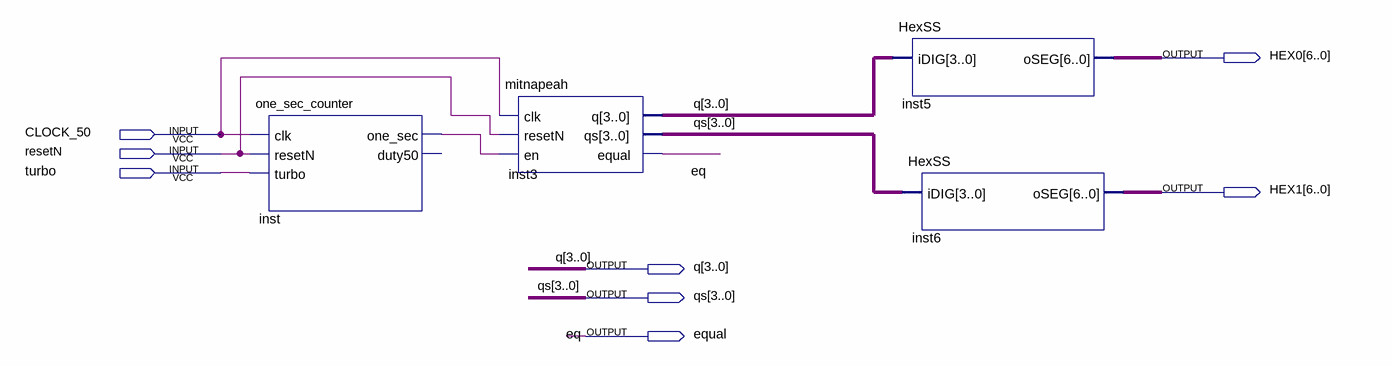
[diagram p0: schematic sheet]
// Quartus schematic mitnapeah_top.bdf as structural Verilog: 4 symbols, 8 pins
module mitnapeah_top (
  input  CLOCK_50,
  input  resetN,
  input  turbo,
  output [6:0] HEX0,
  output [6:0] HEX1,
  output [3:0] q,
  output [3:0] qs,
  output equal
);

  wire inst_one_sec;

  one_sec_counter inst (.clk(CLOCK_50), .resetN(resetN), .turbo(turbo), .one_sec(inst_one_sec));  // open: duty50
  mitnapeah inst3 (.clk(CLOCK_50), .resetN(resetN), .en(inst_one_sec), .q(q), .qs(qs), .equal(equal));
  HexSS inst5 (.iDIG(q), .oSEG(HEX0));
  HexSS inst6 (.iDIG(qs), .oSEG(HEX1));

  // Other names for the same wires on the sheet: eq = equal
endmodule
